# EAGLE schematic 220v-cross-board (EAGLE 5.07)
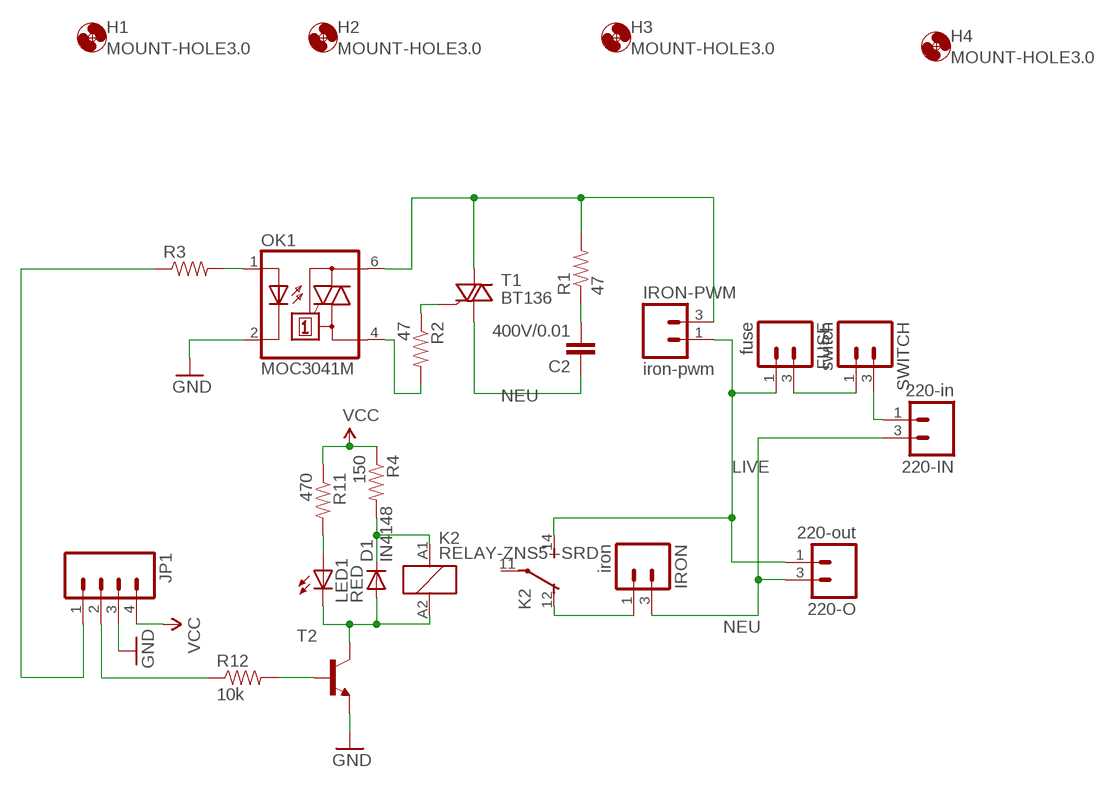
[diagram p0: schematic, sheet 1]

## Parts
220-IN  220-in  CON-02VH-396  [VH-396-2]
220-O  220-out  CON-02VH-396  [VH-396-2]
C2  400V/0.01  CAPPTH3  [CAP-PTH-LARGE]
D1  IN4148  DIODE1N4148  [DIODE-1N4148]
FUSE  fuse  CON-02VH-396  [VH-396-2]
H1  MOUNT-HOLE3.0  [3,0]
H2  MOUNT-HOLE3.0  [3,0]
H3  MOUNT-HOLE3.0  [3,0]
H4  MOUNT-HOLE3.0  [3,0]
IRON  iron  CON-02VH-396  [VH-396-2]
IRON-PWM  iron-pwm  CON-02VH-396  [VH-396-2]
JP1  M04LOCK_LONGPADS  [1X04_LOCK_LONGPADS]
K2  RELAY-ZNS5--SRD  [SRD-05]
LED1  RED  LED5MM  [LED5MM]
OK1  MOC3041M  [DIL06]
R1  47  RESISTOR1/4W  [AXIAL-0.3]
R2  47  RESISTOR1/4W  [AXIAL-0.3]
R3  RESISTOR1/4W  [AXIAL-0.3]
R4  150  RESISTOR1/4W  [AXIAL-0.3]
R11  470  RESISTOR1/4W  [AXIAL-0.3]
R12  10k  RESISTOR1/4W  [AXIAL-0.3]
SWITCH  switch  CON-02VH-396  [VH-396-2]
T1  BT136  [TO220AB]
T2  -NPN-TO92-EBC  [TO92-EBC]

## Nets
GND: JP1.3 OK1.2(C) T2.E
LIVE: 220-O.1 FUSE.1 IRON-PWM.1 K2.14(2:S)
N$1: D1.C K2.A1 R4.P$2
N$2: JP1.1 R3.P$1
N$3: IRON.1 K2.12(2:O)
N$4: IRON-PWM.3 OK1.6(A2) R1.P$2 T1.2(A2)
N$5: 220-IN.1 SWITCH.3
N$6: FUSE.3 SWITCH.1
N$8: R12.P$2 T2.B
N$9: D1.A K2.A2 LED1.K(C) T2.C
N$10: OK1.4(A1) R2.P$2
N$11: R2.P$1 T1.3(G)
N$13: JP1.2 R12.P$1
N$14: C2.2 R1.P$1
N$17: LED1.A R11.P$2
N$18: OK1.1(A) R3.P$2
NEU: 220-IN.3 220-O.3 C2.1 IRON.3 T1.1(A1)
VCC: JP1.4 R4.P$1 R11.P$1
Unconnected: K2.11(2:P)

## Library data of the parts
220-IN 220-O FUSE IRON IRON-PWM SWITCH = digital-toy:CON-02: Header 2 Standard 2-pin 0.1" header. Use with straight break away headers (SKU : PRT-00116), right angle break away headers (PRT-00553), swiss pins (PRT-00743), machine pins (PRT-00117), and female headers (PRT-00115). Molex polarized connector foot print use with SKU : PRT-08233 with associated crimp pins and housings.
C2 = digital-toy:CAP: Capacitor Standard 0603 ceramic capacitor, and 0.1" leaded capacitor.
D1 = digital-toy:DIODE: Diode These are standard reverse protection diodes and small signal diodes. SMA package can handle up to about 1A. SOD-323 can handle about 200mA. What the SOD-323 package when ordering, there are some mfgs out there that are 5-pin packages.
H1-H4 = holes:MOUNT-HOLE: MOUNTING HOLE with drill center marker
JP1 = SparkFun:M04: Header 4 Standard 4-pin 0.1" header. Use with straight break away headers (SKU : PRT-00116), right angle break away headers (PRT-00553), swiss pins (PRT-00743), machine pins (PRT-00117), and female headers (PRT-00115). Molex polarized connector foot print use with SKU : PRT-08231 with associated crimp pins and housings. 1MM SMD Version SKU: PRT-10208
K2 = digital-toy:RELAY-ZNS5-*: Miniature Power PCB Relay SCHRACK 1pole 10 A Source: http://www.schrack.com/.. 5847.pdf
LED1 = SparkFun:LED: LEDs Standard schematic elements and footprints for 5mm, 3mm, 1206, and 0603 sized LEDs. 5mm - Spark Fun Electronics SKU : COM-00529 (and others)
OK1 = optocoupler:MOC30*: 6-Pin DIP Zero-Cross Optoisolators Triac Driver Output (250/400 Volt Peak) Source: http://www.fairchildsemi.com/ds/MO/MOC3043-M.pdf
R1-R4 R11 R12 = digital-toy:RESISTOR: Resistor Basic schematic elements and footprints for 0603, 1206, and PTH 1/10th watt (small) resistors. digital-toy copy vertical mount of axial-0.3 from rcl.lbr : the 0207/xx
T1 = triac:BT136: Triac BT136 series E sensitive gate Source: http://www.nxp.com/acrobat_download/datasheets/BT136_SERIES_E_2.pdf
T2 = digital-toy:*-NPN-: NPN Transistror most of sot-23 use the pacages sot23-BEC, top C, left B, right E. by hyl, digital-toy. and to-92 use ebc(from-top) by hyl, digital-toy.